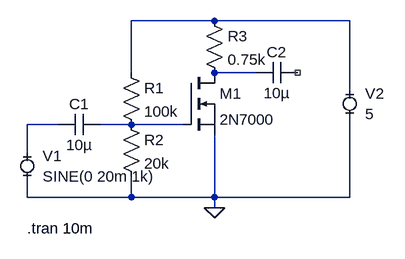
[diagram p0: schematic Draft1.asc]
Draft1.asc, the LTspice schematic file:
Version 4
SHEET 1 880 680
WIRE 320 -304 192 -304
WIRE 528 -304 320 -304
WIRE 192 -224 192 -304
WIRE 384 -224 320 -224
WIRE 528 -192 528 -304
WIRE 80 -144 32 -144
WIRE 192 -144 144 -144
WIRE 272 -144 192 -144
WIRE 32 -96 32 -144
WIRE 32 -32 32 -64
WIRE 192 -32 192 -64
WIRE 192 -32 32 -32
WIRE 320 -32 320 -128
WIRE 320 -32 192 -32
WIRE 528 -32 528 -160
WIRE 528 -32 320 -32
WIRE 320 -16 320 -32
FLAG 320 -16 0
SYMBOL res 176 -240 R0
SYMATTR InstName R1
SYMATTR Value 100k
SYMBOL res 176 -160 R0
SYMATTR InstName R2
SYMATTR Value 20k
SYMBOL res 304 -320 R0
SYMATTR InstName R3
SYMATTR Value 0.75k
SYMBOL nmos 272 -224 R0
SYMATTR InstName M1
SYMATTR Value 2N7000
SYMBOL cap 144 -160 R90
WINDOW 0 0 32 VBottom 2
WINDOW 3 32 32 VTop 2
SYMATTR InstName C1
SYMATTR Value 10µ
SYMBOL cap 448 -240 R90
WINDOW 0 0 32 VBottom 2
WINDOW 3 32 32 VTop 2
SYMATTR InstName C2
SYMATTR Value 10µ
SYMBOL MiniSyms4\\voltage- 528 -176 R0
WINDOW 123 0 0 Left 2
WINDOW 39 0 0 Left 2
SYMATTR InstName V2
SYMATTR Value 5
SYMBOL MiniSyms4\\voltage- 32 -80 R0
WINDOW 123 0 0 Left 2
WINDOW 39 0 0 Left 2
SYMATTR InstName V1
SYMATTR Value SINE(0 20m 1k)
TEXT 32 16 Left 2 !.tran 10m

The netlist it stands for:
* Draft1.asc
R1 N001 N004 100k
R2 N004 0 20k
R3 N001 N002 0.75k
M1 N002 N004 0 0 2N7000
C1 N004 N003 10µ
C2 NC_01 N002 10µ
V2 N001 0 5
V1 N003 0 SINE(0 20m 1k)
.model NMOS NMOS
.model PMOS PMOS
.lib standard.mos
.tran 10m
.backanno
.end